# EAGLE design adrf6850-breakout (EAGLE 5.11)
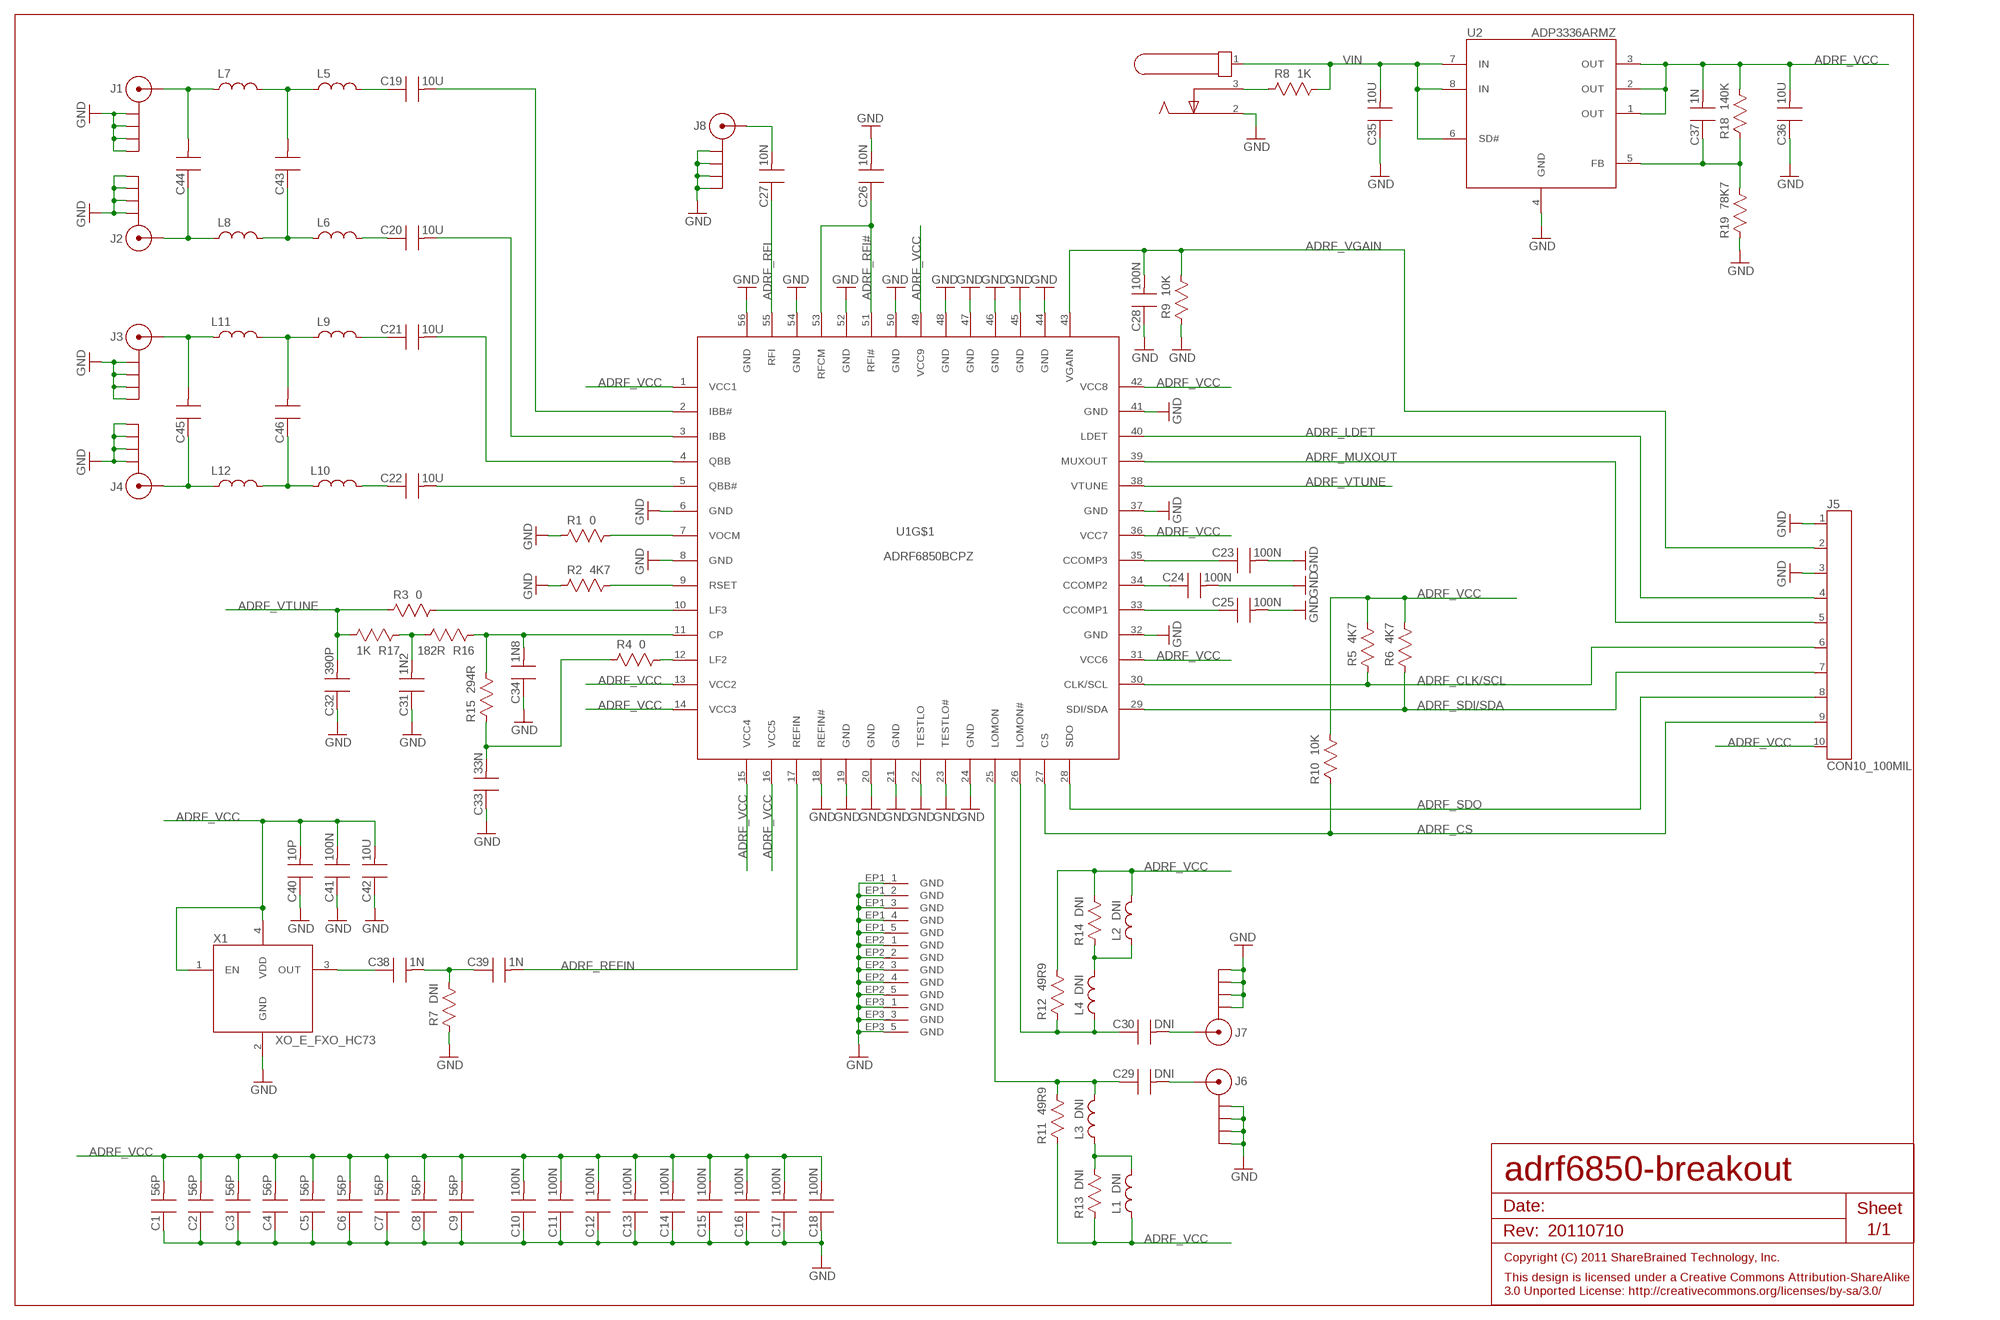
[diagram p0: schematic, sheet 1]

## Parts
C1  56P  C0402_55  [CAPC1005X55N]
C2  56P  C0402_55  [CAPC1005X55N]
C3  56P  C0402_55  [CAPC1005X55N]
C4  56P  C0402_55  [CAPC1005X55N]
C5  56P  C0402_55  [CAPC1005X55N]
C6  56P  C0402_55  [CAPC1005X55N]
C7  56P  C0402_55  [CAPC1005X55N]
C8  56P  C0402_55  [CAPC1005X55N]
C9  56P  C0402_55  [CAPC1005X55N]
C10  100N  C0603_90  [CAPC1608X90N]
C11  100N  C0603_90  [CAPC1608X90N]
C12  100N  C0603_90  [CAPC1608X90N]
C13  100N  C0603_90  [CAPC1608X90N]
C14  100N  C0603_90  [CAPC1608X90N]
C15  100N  C0603_90  [CAPC1608X90N]
C16  100N  C0603_90  [CAPC1608X90N]
C17  100N  C0603_90  [CAPC1608X90N]
C18  100N  C0603_90  [CAPC1608X90N]
C19  10U  C0603_90  [CAPC1608X90N]
C20  10U  C0603_90  [CAPC1608X90N]
C21  10U  C0603_90  [CAPC1608X90N]
C22  10U  C0603_90  [CAPC1608X90N]
C23  100N  C0603_90  [CAPC1608X90N]
C24  100N  C0603_90  [CAPC1608X90N]
C25  100N  C0603_90  [CAPC1608X90N]
C26  10N  C0402_55  [CAPC1005X55N]
C27  10N  C0402_55  [CAPC1005X55N]
C28  100N  C0402_55  [CAPC1005X55N]
C29  DNI  C0402_55  [CAPC1005X55N]
C30  DNI  C0402_55  [CAPC1005X55N]
C31  1N2  C0603_90  [CAPC1608X90N]
C32  390P  C0603_90  [CAPC1608X90N]
C33  33N  C0603_90  [CAPC1608X90N]
C34  1N8  C0603_90  [CAPC1608X90N]
C35  10U  C0805_135  [CAPC2012X135N]
C36  10U  C0805_135  [CAPC2012X135N]
C37  1N  C0603_90  [CAPC1608X90N]
C38  1N  C0603_90  [CAPC1608X90N]
C39  1N  C0603_90  [CAPC1608X90N]
C40  10P  C0402_55  [CAPC1005X55N]
C41  100N  C0603_90  [CAPC1608X90N]
C42  10U  C0805_135  [CAPC2012X135N]
C43  C0603_90  [CAPC1608X90N]
C44  C0603_90  [CAPC1608X90N]
C45  C0603_90  [CAPC1608X90N]
C46  C0603_90  [CAPC1608X90N]
J1  SMA142-0701-801  [142-0701-801]
J2  SMA142-0701-801  [142-0701-801]
J3  SMA142-0701-801  [142-0701-801]
J4  SMA142-0701-801  [142-0701-801]
J5  CON10_100MIL  [STAKE_100MIL_10]
J6  SMA142-0701-801  [142-0701-801]
J7  SMA142-0701-801  [142-0701-801]
J8  SMA142-0701-801  [142-0701-801]
J9  DC_3_CUI_PJ102A  [CUI_PJ_102A]
L1  DNI  L0806_180  [INDC2016X180N]
L2  DNI  L0806_180  [INDC2016X180N]
L3  DNI  L0402_60  [INDC1005X60N]
L4  DNI  L0402_60  [INDC1005X60N]
L5  L0603_95  [INDC1608X95N]
L6  L0603_95  [INDC1608X95N]
L7  L0603_95  [INDC1608X95N]
L8  L0603_95  [INDC1608X95N]
L9  L0603_95  [INDC1608X95N]
L10  L0603_95  [INDC1608X95N]
L11  L0603_95  [INDC1608X95N]
L12  L0603_95  [INDC1608X95N]
R1  0  R0402_40  [RESC1005X40N]
R2  4K7  R0402_40  [RESC1005X40N]
R3  0  R0603_55  [RESC1608X55N]
R4  0  R0603_55  [RESC1608X55N]
R5  4K7  R0402_40  [RESC1005X40N]
R6  4K7  R0402_40  [RESC1005X40N]
R7  DNI  R0402_40  [RESC1005X40N]
R8  1K  R0603_55  [RESC1608X55N]
R9  10K  R0402_40  [RESC1005X40N]
R10  10K  R0402_40  [RESC1005X40N]
R11  49R9  R0402_40  [RESC1005X40N]
R12  49R9  R0402_40  [RESC1005X40N]
R13  DNI  R0805_70  [RESC2012X70N]
R14  DNI  R0805_70  [RESC2012X70N]
R15  294R  R0603_55  [RESC1608X55N]
R16  182R  R0603_55  [RESC1608X55N]
R17  1K  R0603_55  [RESC1608X55N]
R18  140K  R0603_55  [RESC1608X55N]
R19  78K7  R0603_55  [RESC1608X55N]
U1  ADRF6850BCPZ  [CP-56-5]
U2  ADP3336ARMZ  [SOP65P490X110-8N]
X1  XO_E_FXO_HC73  [FXO_HC73]

## Nets
ADRF_CLK/SCL: J5.6 R5.1 U1.30(CLK/SCL)
ADRF_CS: J5.9 R10.1 U1.27(CS)
ADRF_LDET: J5.4 U1.40(LDET)
ADRF_MUXOUT: J5.5 U1.39(MUXOUT)
ADRF_REFIN: C39.2 U1.17(REFIN)
ADRF_RFI [50ohm]: C27.1 U1.55(RFI)
ADRF_RFI# [50ohm]: C26.1 U1.51(RFI#) U1.53(RFCM)
ADRF_SDI/SDA: J5.7 R6.1 U1.29(SDI/SDA)
ADRF_SDO: J5.8 U1.28(SDO)
ADRF_VCC: C1.2 C2.2 C3.2 C4.2 C5.2 C6.2 C7.2 C8.2 C9.2 C10.2 C11.2 C12.2 C13.2 C14.2 C15.2 C16.2 C17.2 C18.2 C36.2 C37.2 C40.2 C41.2 C42.2 J5.10 L1.1 L2.2 R5.2 R6.2 R10.2 R11.1 R12.2 R13.1 R14.2 R18.2 U1.1(VCC1) U1.13(VCC2) U1.14(VCC3) U1.15(VCC4) U1.16(VCC5) U1.31(VCC6) U1.36(VCC7) U1.42(VCC8) U1.49(VCC9) U2.1(OUT) U2.2(OUT) U2.3(OUT) X1.1(EN) X1.4(VDD)
ADRF_VGAIN: C28.2 J5.2 R9.2 U1.43(VGAIN)
ADRF_VTUNE: C32.2 R3.1 R17.2 U1.38(VTUNE)
GND: C1.1 C2.1 C3.1 C4.1 C5.1 C6.1 C7.1 C8.1 C9.1 C10.1 C11.1 C12.1 C13.1 C14.1 C15.1 C16.1 C17.1 C18.1 C23.2 C24.2 C25.2 C26.2 C28.1 C31.1 C32.1 C33.1 C34.1 C35.1 C36.1 C40.1 C41.1 C42.1 J1.RING@1(RING) J1.RING@2(RING) J1.RING@3(RING) J1.RING@4(RING) J2.RING@1(RING) J2.RING@2(RING) J2.RING@3(RING) J2.RING@4(RING) J3.RING@1(RING) J3.RING@2(RING) J3.RING@3(RING) J3.RING@4(RING) J4.RING@1(RING) J4.RING@2(RING) J4.RING@3(RING) J4.RING@4(RING) J5.1 J5.3 J6.RING@1(RING) J6.RING@2(RING) J6.RING@3(RING) J6.RING@4(RING) J7.RING@1(RING) J7.RING@2(RING) J7.RING@3(RING) J7.RING@4(RING) J8.RING@1(RING) J8.RING@2(RING) J8.RING@3(RING) J8.RING@4(RING) J9.2 R1.1 R2.1 R7.1 R9.1 R19.1 U1.6(GND) U1.8(GND) U1.18(REFIN#) U1.19(GND) U1.20(GND) U1.21(GND) U1.22(TESTLO) U1.23(TESTLO#) U1.24(GND) U1.32(GND) U1.37(GND) U1.41(GND) U1.44(GND) U1.45(GND) U1.46(GND) U1.47(GND) U1.48(GND) U1.50(GND) U1.52(GND) U1.54(GND) U1.56(GND) U1.EP1_1(GND) U1.EP1_2(GND) U1.EP1_3(GND) U1.EP1_4(GND) U1.EP1_5(GND) U1.EP2_1(GND) U1.EP2_2(GND) U1.EP2_3(GND) U1.EP2_4(GND) U1.EP2_5(GND) U1.EP3_1(GND) U1.EP3_3(GND) U1.EP3_5(GND) U2.4(GND) X1.2(GND)
N$1 [50ohm]: C43.2 L5.1 L7.2
N$2 [50ohm]: C43.1 L6.1 L8.2
N$3 [50ohm]: C46.2 L9.1 L11.2
N$4 [50ohm]: C46.1 L10.1 L12.2
N$5 [50ohm]: C19.2 U1.2(IBB#)
N$6 [50ohm]: C20.2 U1.3(IBB)
N$7 [50ohm]: C21.2 U1.4(QBB)
N$8 [50ohm]: C22.2 U1.5(QBB#)
N$9: C23.1 U1.35(CCOMP3)
N$10: C24.1 U1.34(CCOMP2)
N$11: C25.1 U1.33(CCOMP1)
N$12: C33.2 R4.1 R15.1
N$13: R1.2 U1.7(VOCM)
N$14: R2.2 U1.9(RSET)
N$15: C34.2 R15.2 R16.1 U1.11(CP)
N$16: R3.2 U1.10(LF3)
N$17: R4.2 U1.12(LF2)
N$18: C31.2 R16.2 R17.1
N$19 [50ohm]: C30.2 J7.TIP
N$20 [50ohm]: C30.1 L4.1 R12.1 U1.26(LOMON#)
N$21 [50ohm]: C20.1 L6.2
N$22 [50ohm]: C27.2 J8.TIP
N$23: C38.1 X1.3(OUT)
N$24: C37.1 R18.1 R19.2 U2.5(FB)
N$25 [50ohm]: C38.2 C39.1 R7.2
N$26 [50ohm]: C19.1 L5.2
N$27 [50ohm]: C44.2 J1.TIP L7.1
N$28 [50ohm]: C44.1 J2.TIP L8.1
N$29 [50ohm]: C45.2 J3.TIP L11.1
N$30 [50ohm]: C45.1 J4.TIP L12.1
N$31 [50ohm]: C22.1 L10.2
N$32: L2.1 L4.2 R14.1
N$33 [50ohm]: C29.2 J6.TIP
N$34 [50ohm]: C29.1 L3.2 R11.2 U1.25(LOMON)
N$35: L1.2 L3.1 R13.2
N$36 [50ohm]: C21.1 L9.2
N$37: J9.3 R8.1
VIN: C35.2 J9.1 R8.2 U2.6(SD#) U2.7(IN) U2.8(IN)

## Notes on the sheet
- 20110710

## Library data of the parts
C1-C46 = capacitor:C
J1-J4 J6-J8 = sma:SMA
J5 = stake:CON10
J9 = dc_connector:DC_3
L1-L12 = inductor:L
R1-R19 = resistor:R
U1 = analog_devices:ADRF6850
U2 = analog_devices:ADP3336?
X1 = oscillator:XO_E

## Net classes
1 50ohm: width 0.3 mm, clearance 0.6 mm

## Board
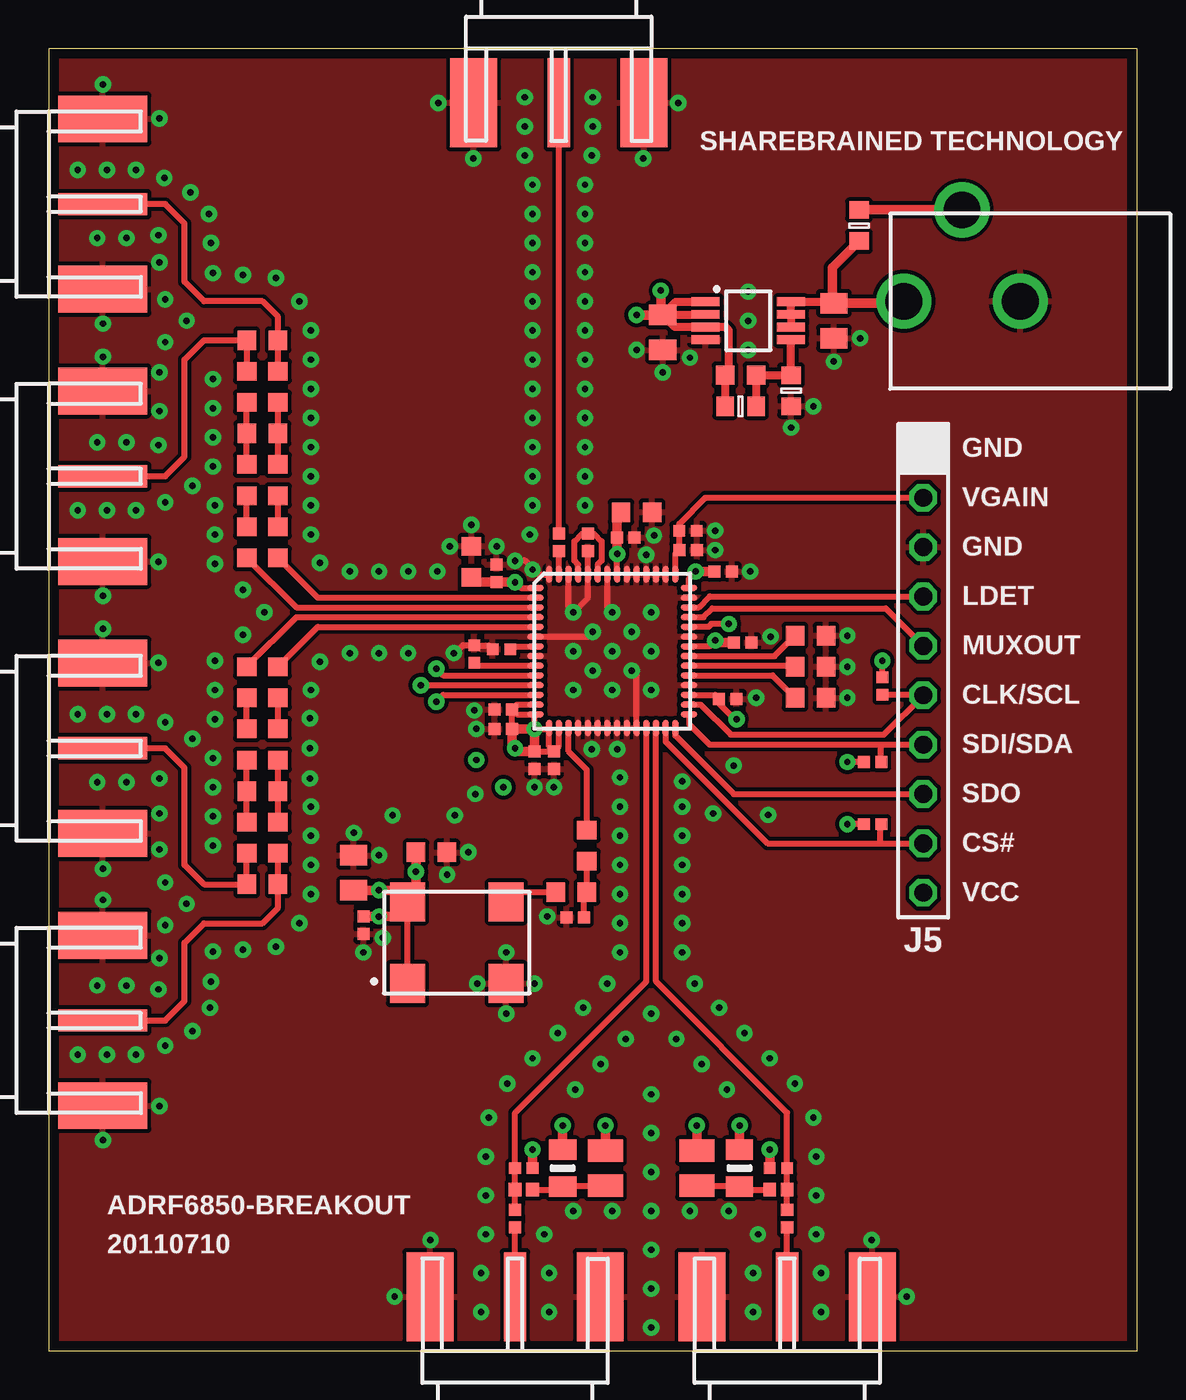
[diagram p1: board, top side]
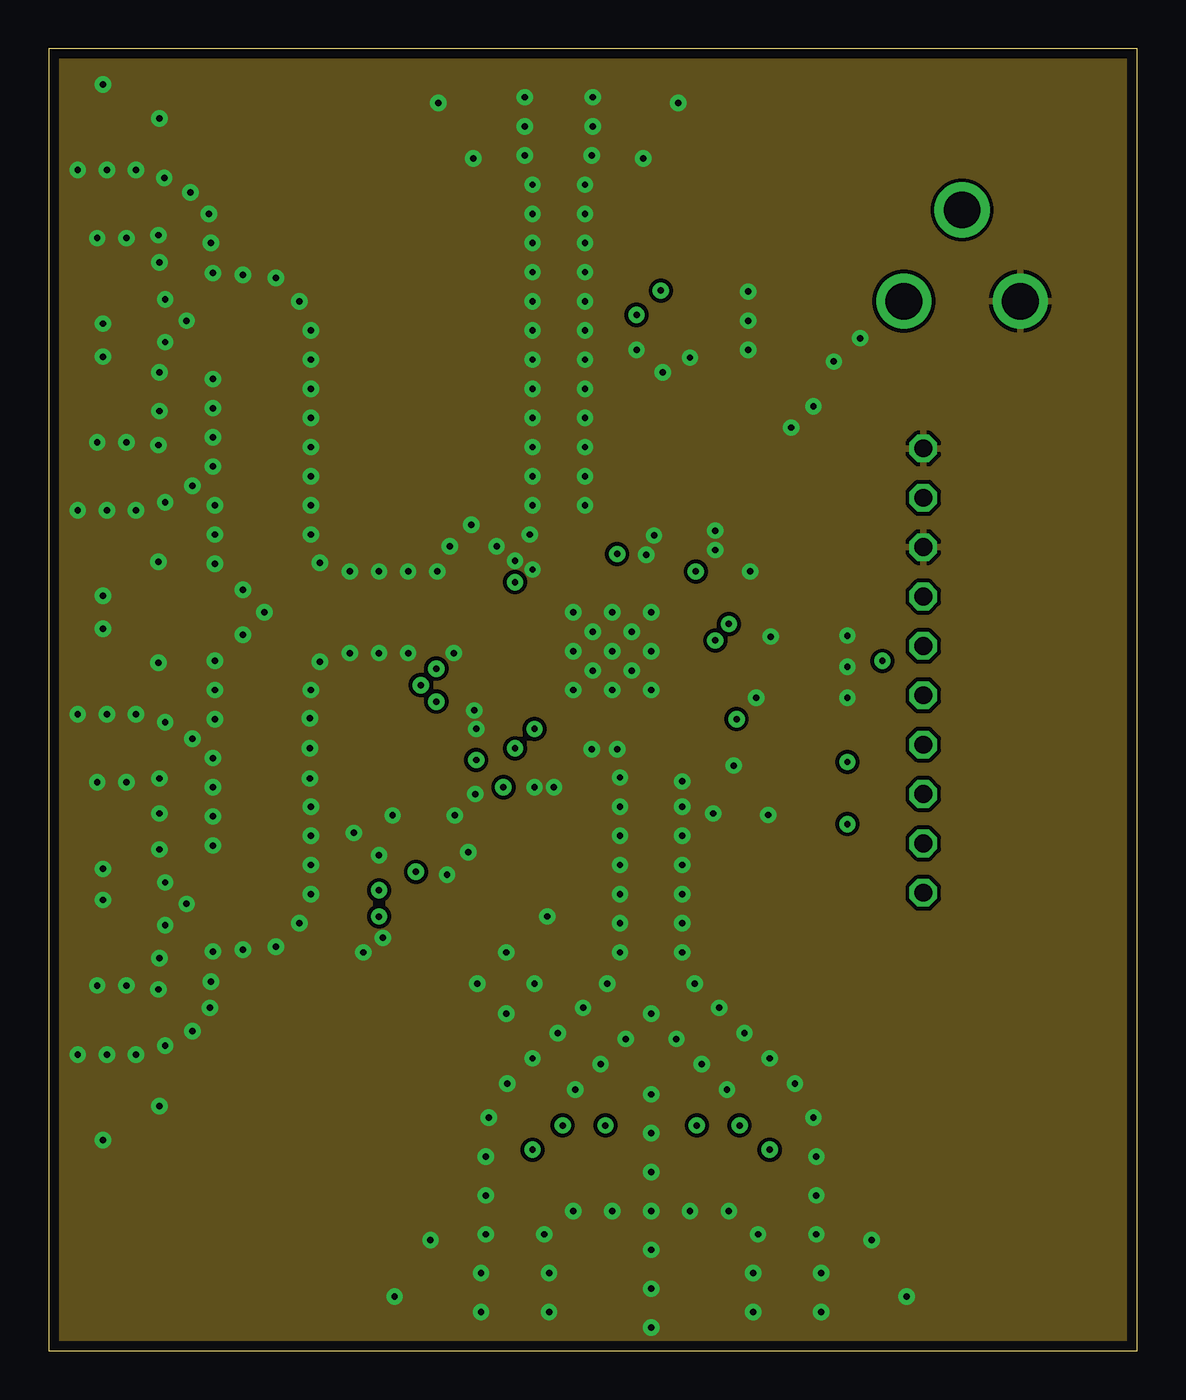
[diagram p2: board, inner layer Route2]
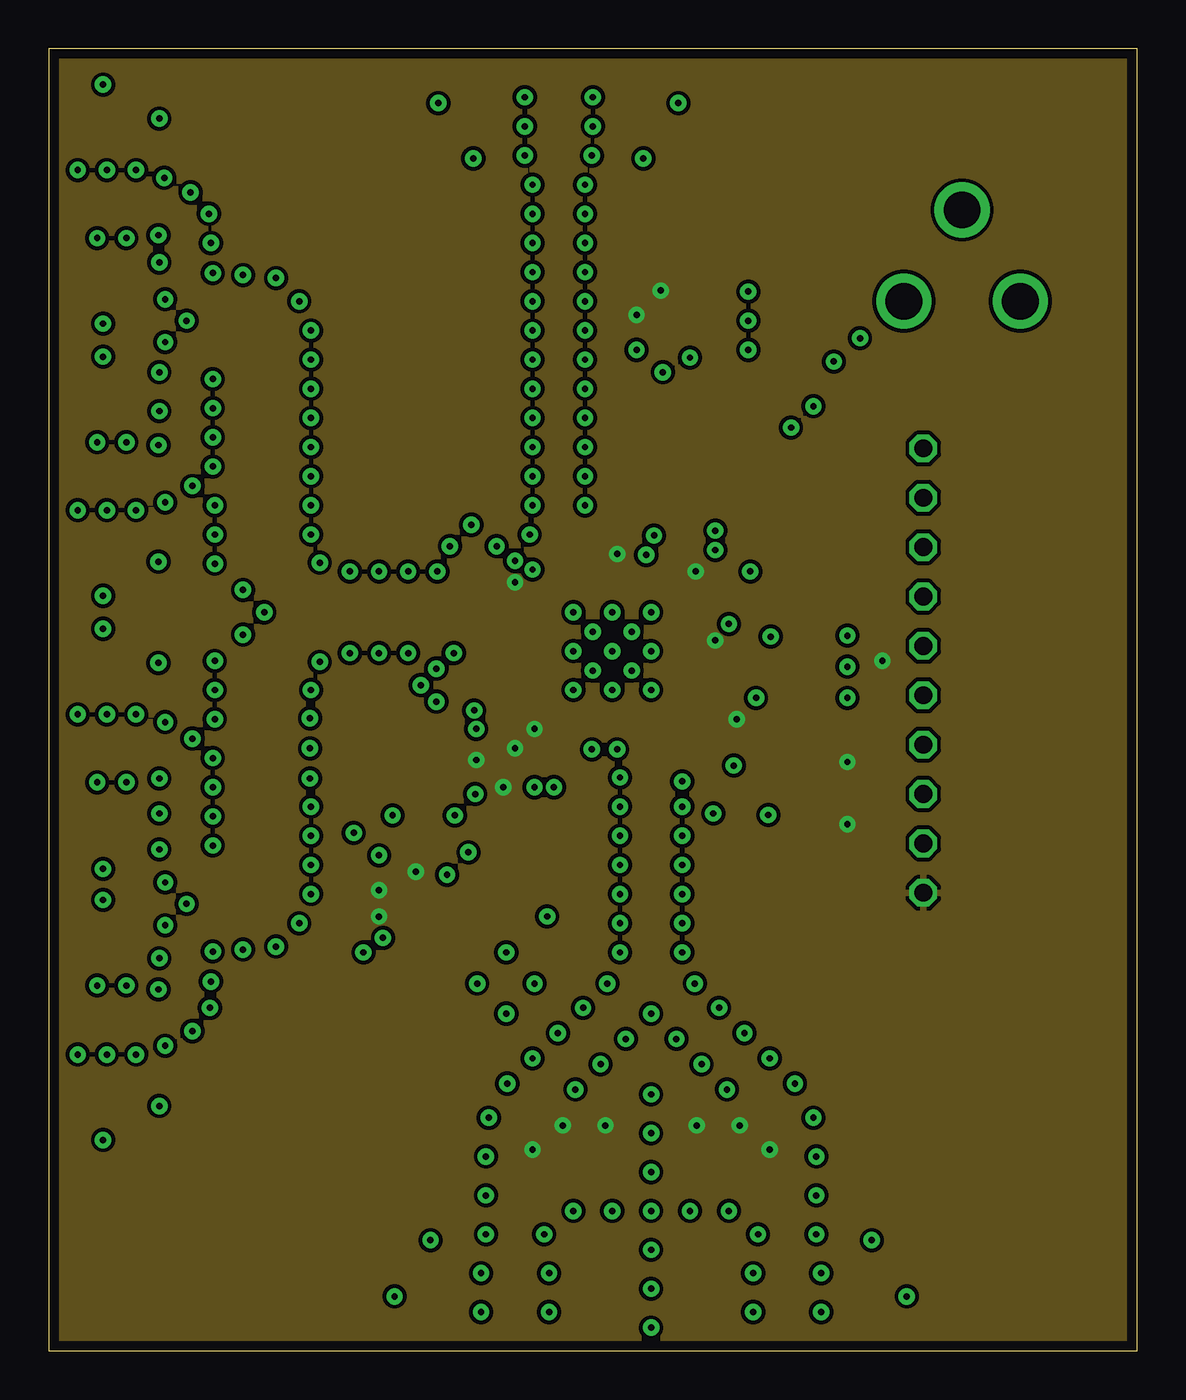
[diagram p3: board, inner layer Route15]
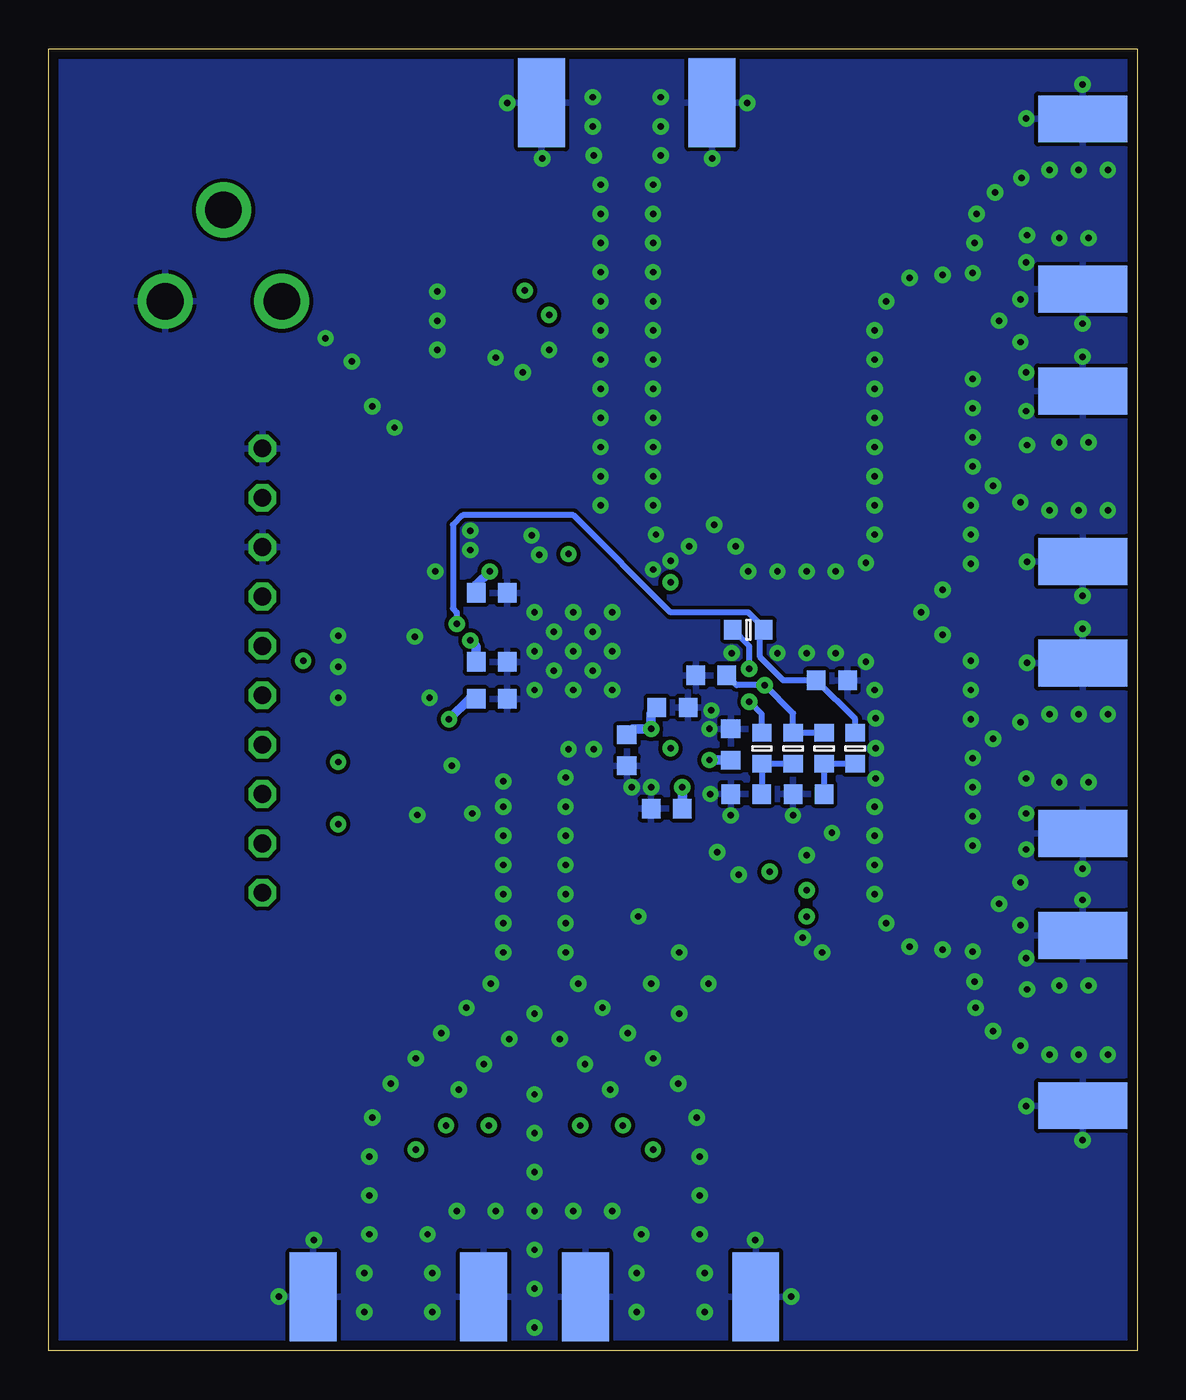
[diagram p4: board, bottom side, seen from below]

Size 56 x 67 mm. Coordinates in mm from the lower left corner, seen from the top.
Outline: 0,0 56,0 56,67 0,67 0,0
Copper layers (1+2*15+16): Top 0.0178mm / dielectric 0.1981mm / Route2 0.0356mm / dielectric 0.9906mm / Route15 0.0356mm / dielectric 0.1981mm / Bottom 0.0178mm
Design rules "adrf6850-breakout *": minimum track width 0.3mm, minimum drill 13mil, track to track 0.2mm, track to pad 0.2mm, pad to pad 0.2mm, via to via 0.2mm, smd to smd 0.2mm, copper to edge 20mil, drill to drill 16mil, minimum pad ring 10mil, minimum via ring 10mil, stop-mask expansion 3mil, vias tented up to drill 13mil, thermal gap 8mil

### Footprints (pad centres in the part's own frame; a part is rotated, then mirrored left to right if it is on the bottom)
CAPC1005X55N = smd 0.62 x 0.62: 1 -0.45,0; 2 0.45,0
CAPC1608X90N = smd 0.95 x 1: 1 -0.8,0; 2 0.8,0
CAPC2012X135N = smd 1.05 x 1.4: 1 -0.9,0; 2 0.9,0
142-0701-801 = smd 2.413 x 4.572: RING@1 -4.381,-2.794; RING@2 4.381,-2.794 | smd 2.413 x 4.572 bottom: RING@3 -4.381,-2.794; RING@4 4.381,-2.794 | smd 1.143 x 4.572: TIP 0,-2.794
STAKE_100MIL_10 = drill 0.914 octagon: 1 -11.43,0; 2 -8.89,0; 3 -6.35,0; 4 -3.81,0; 5 -1.27,0; 6 1.27,0; 7 3.81,0; 8 6.35,0; 9 8.89,0; 10 11.43,0
CUI_PJ_102A = drill 1.887 round: 1 0,-3; 2 0,3; 3 -4.7,0
INDC2016X180N = smd 1.15 x 1.8: 1 -0.9,0; 2 0.9,0
INDC1005X60N = smd 0.65 x 0.7: 1 -0.45,0; 2 0.45,0
INDC1608X95N = smd 0.95 x 1: 1 -0.8,0; 2 0.8,0
RESC1005X40N = smd 0.6 x 0.6: 1 -0.45,0; 2 0.45,0
RESC1608X55N = smd 0.9 x 1: 1 -0.8,0; 2 0.8,0
RESC2012X70N = smd 1.05 x 1.4: 1 -0.95,0; 2 0.95,0
CP-56-5 = smd 0.85 x 0.3: 1 -3.95,3.25; 2 -3.95,2.75; 3 -3.95,2.25; 4 -3.95,1.75; 5 -3.95,1.25; 6 -3.95,0.75; 7 -3.95,0.25; 8 -3.95,-0.25; 9 -3.95,-0.75; 10 -3.95,-1.25; 11 -3.95,-1.75; 12 -3.95,-2.25; 13 -3.95,-2.75; 14 -3.95,-3.25; 29 3.95,-3.25; 30 3.95,-2.75; 31 3.95,-2.25; 32 3.95,-1.75; 33 3.95,-1.25; 34 3.95,-0.75; 35 3.95,-0.25; 36 3.95,0.25; 37 3.95,0.75; 38 3.95,1.25; 39 3.95,1.75; 40 3.95,2.25; 41 3.95,2.75; 42 3.95,3.25 | smd 0.3 x 0.85: 15 -3.25,-3.95; 16 -2.75,-3.95; 17 -2.25,-3.95; 18 -1.75,-3.95; 19 -1.25,-3.95; 20 -0.75,-3.95; 21 -0.25,-3.95; 22 0.25,-3.95; 23 0.75,-3.95; 24 1.25,-3.95; 25 1.75,-3.95; 26 2.25,-3.95; 27 2.75,-3.95; 28 3.25,-3.95; 43 3.25,3.95; 44 2.75,3.95; 45 2.25,3.95; 46 1.75,3.95; 47 1.25,3.95; 48 0.75,3.95; 49 0.25,3.95; 50 -0.25,3.95; 51 -0.75,3.95; 52 -1.25,3.95; 53 -1.75,3.95; 54 -2.25,3.95; 55 -2.75,3.95; 56 -3.25,3.95 | drill 0.33 round: EP1_1 -2,2; EP1_2 -1,1; EP1_3 -2,0; EP1_4 -1,-1; EP1_5 -2,-2; EP2_1 0,2; EP2_2 1,1; EP2_3 0,0; EP2_4 1,-1; EP2_5 0,-2; EP3_1 2,2; EP3_3 2,0; EP3_5 2,-2
SOP65P490X110-8N = smd 1.45 x 0.45: 1 -2.2,0.975; 2 -2.2,0.325; 3 -2.2,-0.325; 4 -2.2,-0.975; 5 2.2,-0.975; 6 2.2,-0.325; 7 2.2,0.325; 8 2.2,0.975
FXO_HC73 = smd 1.8 x 2: 1 -2.54,-2.1; 2 2.54,-2.1; 3 2.54,2.1; 4 -2.54,2.1

### Placement (x,y rotation side)
C1  23.05,40 270 top
C2  23.4,33 0 top
C3  23.4,32 0 top
C4  25,30.4 90 top
C5  26,30.4 90 top
C6  34.95,33.55 180 top
C7  35.7,36.45 180 top
C8  34.7,40.1 180 top
C9  29.7,41.85 180 top
C10  21.75,40.6 270 top
C11  20.9,31.2 270 bottom
C12  23.9,33.1 180 bottom
C13  26.25,30.9 90 bottom
C14  24.2,27.9 0 bottom
C15  33.2,33.55 180 bottom
C16  33.2,35.45 180 bottom
C17  33.2,39 180 bottom
C18  30.25,43.15 180 top
C19  11.8,41.6 270 top
C20  10.2,41.6 270 top
C21  10.2,34.4 90 top
C22  11.8,34.4 90 top
C23  39.2,36.8 0 top
C24  39.2,35.2 0 top
C25  39.2,33.6 0 top
C26  27.75,41.6 270 top
C27  26.25,41.6 90 top
C28  32.9,41.2 180 top
C29  24,6.8 270 top
C30  38,6.8 270 top
C31  16.9,28.65 0 bottom
C32  15.7,34.5 180 bottom
C33  20.1,28.65 0 bottom
C34  21.9,34.75 0 bottom
C35  40.4,53 90 top
C36  31.6,52.4 90 top
C37  35.6,50.2 180 top
C38  26.9,23.6 0 top
C39  27.7,26 90 top
C40  16.2,21.9 90 top
C41  19.7,25.65 180 top
C42  15.7,24.6 270 top
C43  11,47.2 0 top
C44  11,52 0 top
C45  11,24 180 top
C46  11,28.8 180 top
J1  0,59 90 top
J2  0,45 90 top
J3  0,31 90 top
J4  0,17 90 top
J5  45,35 270 top
J6  24,0 180 top
J7  38,0 180 top
J8  26.25,67 0 top
J9  47,54 270 top
L1  28.65,9.4 270 top
L2  33.35,9.4 90 top
L3  24.45,8.3 180 top
L4  37.55,8.3 180 top
L5  11.8,44.8 270 top
L6  10.2,44.8 270 top
L7  11.8,49.6 270 top
L8  10.2,49.6 270 top
L9  10.2,31.2 90 top
L10  11.8,31.2 90 top
L11  10.2,26.4 90 top
L12  11.8,26.4 90 top
R1  23.3,36.1 0 top
R2  21.9,35.85 270 top
R3  20,37.1 180 bottom
R4  19.3,31 90 bottom
R5  42.9,34.2 90 top
R6  42.4,30.3 180 top
R7  27.1,22.3 0 top
R8  41.7,57.9 270 top
R9  32.9,42.2 180 top
R10  42.4,27.1 180 top
R11  24.45,9.4 180 top
R12  37.55,9.4 180 top
R13  26.45,9.4 270 top
R14  35.55,9.4 90 top
R15  17.7,31 90 bottom
R16  16.1,31 270 bottom
R17  14.5,31 90 bottom
R18  35.6,48.6 180 top
R19  38.2,49.4 90 top
U1  29,36 0 top
U2  36,53 0 top
X1  21,21 0 top

### Tracks (layer width: path | path; a pad name or v marks a point on that pad's centre or on a via)
ADRF_CLK/SCL
  Top 0.3: U1.30 33.55,33.25 35.1,31.7 42.97,31.7 J5.6 44.98,33.75 R5.1
ADRF_CS
  Top 0.3: U1.27 31.75,31.35 36.99,26.11 42.8,26.11 | 42.8,26.11 J5.9 | R10.1 42.8,27.1 42.8,26.11
ADRF_LDET
  Top 0.3: U1.40 33.45,38.25 34.01,38.81 J5.4
ADRF_MUXOUT
  Top 0.3: U1.39 33.7,37.75 34.15,38.2 43.07,38.2 J5.5
ADRF_REFIN
  Top 0.3: U1.17 26.75,30.85 27.7,29.9 C39.2
ADRF_RFI
  Top 0.3: U1.55 C27.1
ADRF_RFI#
  Top 0.3: U1.51 28.25,40.45 28.45,40.65 28.45,41.65 28.05,42.05 C26.1 27.45,42.05 27.05,41.65 27.05,40.65 27.25,40.45 U1.53
ADRF_SDI/SDA
  Top 0.3: U1.29 32.95,32.25 34.01,31.19 42.8,31.19 | 42.8,31.19 J5.7 | R6.1 42.8,30.3 42.8,31.19
ADRF_SDO
  Top 0.3: U1.28 32.25,31.65 35.25,28.65 J5.8
ADRF_VCC  (via drill 0.33)
  Top 0.3: U1.13 24.1,33.25 C2.2 | U1.14 24.1,32.75 C2.2 | U1.16 26.25,31.1 C5.2 | U1.15 25.75,31.1 C5.2 | C4.2 C5.2 | C3.2 C2.2 | 24.15,30.85 v24,31 | U1.31 34.3,33.75 C6.2 34.5,33.3 35.3,32.5 v35.4,32.5 | U1.42 32.95,39.75 v33.3,40.1 | R6.2 v41.1,30.3 | R5.2 v42.9,35.5 | R10.2 v41.1,27.1 | 25,32.7 v25,32 25.7,32 | X1.1 X1.4 | U1.1 24.3,39.25 v24,39.55 | U1.36 34,36.25 v34.3,36.55 | U1.49 v29.25,41
  Top 0.33: C36.2 31.5,53.4
  Top 0.4: U2.2 31.62,53.33 C36.2 | C36.2 32.23,52.67 U2.3 34.83,52.67 35,52.5 35,50.4 C37.2 R18.2 | U2.1 32.27,53.98 C36.2
  Top 0.5: 24.15,30.85 C4.2 v25,32 23.8,32 | C3.2 23.85,31.15 v24,31 | L2.2 v33.35,11.6 | R14.2 v35.55,11.6 | R12.2 v37.1,10.35 | 31.5,53.4 v31.5,54.55 | v30.25,53.3 31.5,53.3 | R11.1 v24.9,10.35 | R13.1 v26.45,11.6 | L1.1 v28.65,11.6 | X1.4 17.71,22.35 v17,22.35 C40.2 | X1.4 17.86,23.7 v17,23.7 C42.2 | X1.4 18.9,23.54 v18.9,24.65 C41.2 | v24,39.55 C1.2 22,39.55 C10.2 | v34.3,36.55 34.4,36.45 C7.2 | v29.25,41 C9.2 29.25,42.95 C18.2 | v33.3,40.1 C8.2
  Bottom 0.5: C12.2 25,32.8 v25,32 25.95,32 C13.2 | C11.2 v22,30.4 | C14.2 v23.4,29 | C17.2 34,39.4 v33.3,40.1 | C15.2 34.35,33.55 v35.4,32.5 | C16.2 34,36.25 v34.3,36.55
  pour Route15: 0,0 0,67 56,67 56,0
ADRF_VGAIN
  Top 0.3: J5.2 33.79,43.89 32.45,42.55 R9.2 C28.2 32.25,41 U1.43
ADRF_VTUNE  (via drill 0.33)
  Top 0.3: U1.38 33.95,37.25 34.1,37.4 v35,37.4
  Bottom 0.3: R17.2 14.5,32.5 C32.2 18.2,34.5 19.4,35.7 19.4,36.9 R3.1 19.2,37.2 20,38 24,38 29,43 34.7,43 35.2,42.5 35.2,38.2 35,38 v35,37.4
GND  (via drill 0.33)
  Top 0.3: U1.6 27.75,36.75 U1.EP1_2 | U1.56 25.2,39.95 24.5,40.65 v24,40.65 | U1.54 26.75,38.25 U1.EP1_1 27.75,38.75 U1.52 C26.2 | U1.50 28.75,38.25 U1.EP2_1 | R1.1 22.65,36.3 R2.1 21.3,36.3 20.9,35.9 v20.85,35.9 | U1.24 30.25,34.75 U1.EP2_4
  other vias: 26,29 25,29 22,32 21.9,32.95 31.6,50.35 30.25,51.5 33,51.1 39.35,48.6 38.2,47.5 40.4,50.9 41.75,52.1 36,53 36,51.5 36,54.5 22.5,6 22.5,8 27,7.2 25.5,6 25.75,4 25.75,2 22.25,4 22.25,2 29,7.2 31,7.2 31,9.2 31,11.2 33,7.2 35,7.2 36.5,6 36.25,4 36.25,2 39.75,2 39.75,4 39.5,6 39.5,8 31,5.2 31,3.2 31,1.2 39.5,10 22.5,10 22.65,12 39.35,12 31,13.2 37.1,15.05 38.4,13.75 35.8,16.35 34.5,17.65 33.25,18.9 32.6,20.5 31,17.35 32.3,16.05 33.6,14.75 34.9,13.45 29.7,16.05 28.4,14.75 27.1,13.45 23.6,13.75 24.9,15.05 26.2,16.35 27.5,17.65 28.75,18.9 29.4,20.5 41.1,36.8 41.1,35.2 41.1,33.6 37.15,36.75 36.4,33.6 36.1,40.1 34.3,42.2 34.3,41.2 23.05,41.4 21.75,42.5 20.65,41.4 23.55,20.5 25,18.9 22.05,18.9 23.55,17.35 24.9,40.2 17,35.9 15.5,35.9 13.95,35.45 13.5,34 18.5,35.9 13.45,32.55 13.45,31 13.45,29.45 13.5,28 13.5,26.5 13.5,25 13.5,23.5 12.9,22 11.7,20.8 10,20.65 8.45,20.55 8.35,19 8.3,17.65 7.4,16.45 6,15.7 4.5,15.25 3,15.25 2.5,18.8 4,18.8 5.65,18.6 7.1,23 6,21.9 5.7,20.2 6,24.1 5.7,25.8 5.7,29.45 5.7,27.65 4,29.25 2.5,29.25 2.8,24.8 2.8,23.2 2.8,10.85 4.5,32.75 2.8,37.15 3,32.75 6,32.35 7.4,31.5 8.45,30.5 8.45,29 8.45,27.5 8.45,26 8.55,32.5 8.55,34 8.55,35.5 10,36.85 11.1,38 10,39.15 8.55,40.5 8.55,42 8.55,43.5 8.45,50 8.45,48.5 8.45,47 8.45,45.5 7.4,44.5 6,43.65 4.5,43.25 3,43.25 1.5,43.25 1.5,32.75 5.65,35.4 1.5,15.25 20,40.1 18.5,40.1 17,40.1 15.5,40.1 13.95,40.55 13.5,42 13.5,43.5 13.5,45 13.5,46.5 13.5,48 13.5,49.5 13.5,51 13.5,52.5 12.9,54 11.7,55.2 10,55.35 8.45,55.45 8.35,57 8.25,58.5 7.3,59.6 5.95,60.35 4.5,60.75 3,60.75 1.5,60.75 2.5,57.25 4,57.25 5.65,57.4 5.7,56 6,54.1 7.1,53 6,51.9 2.8,52.85 2.8,51.15 2.5,46.75 2.8,38.85 5.65,40.6 4,46.75 5.65,46.6 5.7,48.35 5.7,50.35 5.7,12.6 5.7,63.4 2.8,65.15 31.15,41.95 30.75,40.95 27.6,43.5 24.9,43.5 24.75,42 24.9,45 27.6,45 27.6,46.5 27.6,48 27.6,49.5 27.6,51 27.6,52.5 27.6,54 27.6,55.5 24.9,46.5 24.9,48 24.9,49.5 24.9,51 24.9,52.5 24.9,54 24.9,55.5 27.6,57 27.6,58.5 27.6,60 24.9,58.5 24.9,57 24.9,60 24.5,61.5 27.95,61.5 28,63 24.5,63 24.5,64.5 28,64.5 21.85,61.35 20.05,64.2 30.6,61.35 32.4,64.2 29.4,22 29.4,23.5 29.4,25 29.4,26.5 29.4,28 29.4,29.5 27.95,30.95 29.25,30.95 32.6,22 32.6,23.5 32.6,25 32.6,26.5 32.6,28 34.2,27.65 32.6,29.3 19.65,5.7 17.8,2.8 42.35,5.7 44.15,2.8 17.7,27.55 20.9,27.55 21.95,28.65 15.7,26.65 17,25.5 20.5,24.5 21.6,25.65 17.2,21.25 16.2,20.5 35.25,30.11 37.03,27.57 25.65,22.35
  pour Top: 0,0 0,67 56,67 56,0
  pour Route2: 0,0 0,67 56,67 56,0
  pour Bottom: 0,0 0,67 56,67 56,0
N$1
  Top 0.3: L7.2 C43.2 L5.1
N$2
  Top 0.3: L8.2 C43.1 L6.1
N$3
  Top 0.3: L9.1 C46.2 L11.2
N$4
  Top 0.3: L10.1 C46.1 L12.2
N$5
  Top 0.3: U1.2 13.85,38.75 C19.2
N$6
  Top 0.3: U1.3 12.75,38.25 C20.2
N$7
  Top 0.3: U1.4 12.75,37.75 C21.2
N$8
  Top 0.3: U1.5 13.85,37.25 C22.2
N$9
  Top 0.3: U1.35 37.35,35.75 C23.1
N$10
  Top 0.3: U1.34 38.35,35.25 C24.1
N$11
  Top 0.3: U1.33 37.25,34.75 C25.1
N$12
  Bottom 0.3: R15.1 R4.1 C33.2
N$13
  Top 0.3: U1.7 23.9,36.25 R1.2
N$14
  Top 0.3: U1.9 22.05,35.25 R2.2
N$15  (via drill 0.33)
  Top 0.3: v19.15,34.25 U1.11
  Bottom 0.3: R16.1 R15.2 17.7,32.8 v19.15,34.25 20.6,34.25 C34.2
N$16  (via drill 0.33)
  Top 0.3: U1.10 20.3,34.75 v19.95,35.1
  Bottom 0.3: v19.95,35.1 19.95,36.25 R3.2
N$17  (via drill 0.33)
  Top 0.3: U1.12 20.3,33.75 v19.95,33.4
  Bottom 0.3: R4.2 19.3,32.75 v19.95,33.4
N$18
  Bottom 0.3: R17.1 R16.2 C31.2
N$19
  Top 0.3: J7.TIP C30.2
N$20
  Top 0.3: U1.26 31.25,19 38,12.25 R12.1 L4.1 C30.1
N$21
  Top 0.3: C20.1 L6.2
N$22
  Top 0.3: C27.2 J8.TIP
N$23
  Top 0.3: C38.1 24.04,23.6 X1.3
N$24
  Top 0.4: R18.1 C37.1 R19.2 U2.5
N$25
  Top 0.3: C39.1 C38.2 27.55,23.45 R7.2
N$26
  Top 0.3: C19.1 L5.2
N$27
  Top 0.3: J1.TIP 6,59 7,58 7,55 8,54 11,54 11.8,53.2 C44.2 L7.1
N$28
  Top 0.3: J2.TIP 6,45 7,46 7,51 8,52 C44.1 L8.1
N$29
  Top 0.3: J3.TIP 6,31 7,30 7,25 8,24 C45.2 L11.1
N$30
  Top 0.3: J4.TIP 6,17 7,18 7,21 8,22 11,22 11.8,22.8 C45.1 L12.1
N$31
  Top 0.3: L10.2 C22.1
N$32
  Top 0.3: L4.2 35.7,8.3 R14.1 | L2.1 35.5,8.5
  Top 0.33: 35.5,8.5 R14.1
N$33
  Top 0.3: J6.TIP C29.2
N$34
  Top 0.3: U1.25 30.75,19 24,12.25 R11.2 L3.2 C29.1
N$35
  Top 0.3: L3.1 26.3,8.3 R13.2 | 26.5,8.5 L1.2
  Top 0.33: R13.2 26.5,8.5
N$36
  Top 0.3: L9.2 C21.1
N$37
  Top 0.5: R8.1 J9.3
VIN
  Top 0.4: C35.2 40.33,53.98 U2.8 U2.7 U2.6
  Top 0.5: C35.2 43.9,53.9 J9.1 | 40.33,53.98 40.33,55.73 R8.2

### Text on the board
tPlace: SHAREBRAINED TECHNOLOGY | GND | VGAIN | GND | LDET | MUXOUT | CLK/SCL | SDI/SDA | SDO | CS# | VCC | ADRF6850-BREAKOUT | 20110710